# EAGLE schematic 328P & ISP (EAGLE 7.2.0)
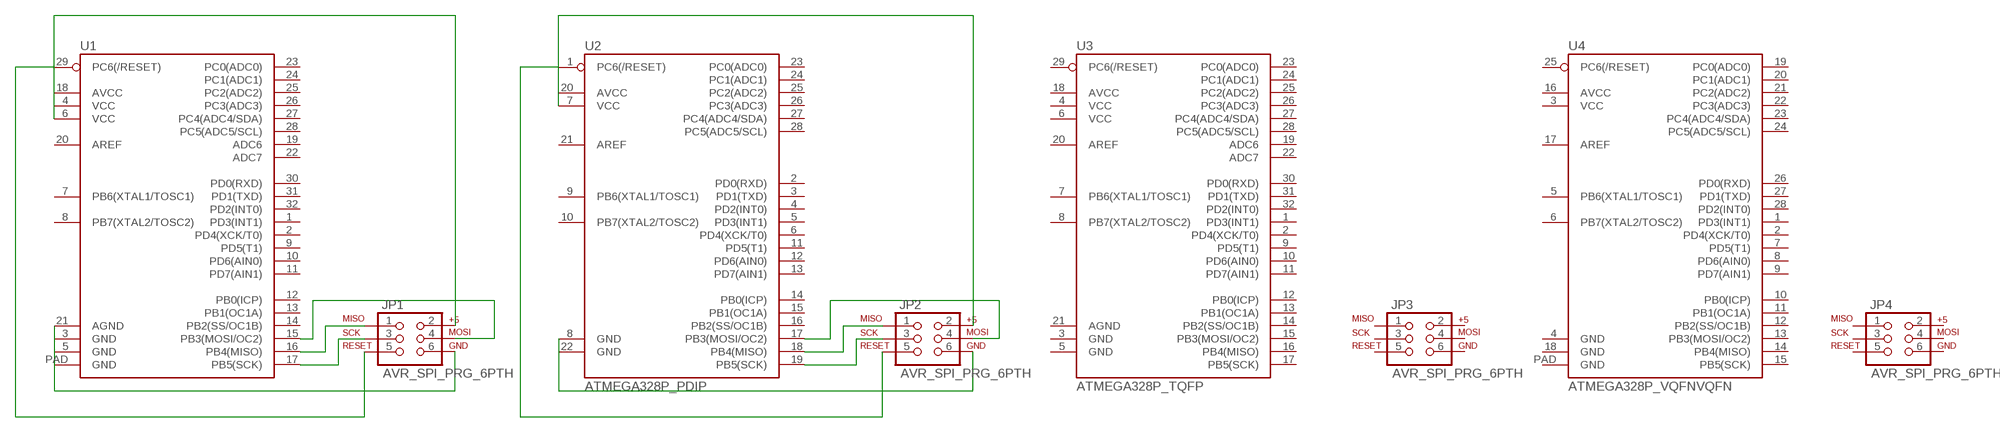
[diagram p0: schematic, sheet 1]

## Parts
JP1  AVR_SPI_PRG_6PTH  [2X3]
JP2  AVR_SPI_PRG_6PTH  [2X3]
JP3  AVR_SPI_PRG_6PTH  [2X3]
JP4  AVR_SPI_PRG_6PTH  [2X3]
U1  ATMEGA328P_MLFMLF32  [MLF32-PAD]
U2  ATMEGA328P_PDIP  [DIL28-3]
U3  ATMEGA328P_TQFP  [TQFP32-08]
U4  ATMEGA328P_VQFNVQFN  [VQFN-28]

## Nets
N$1: JP1.5 U1.29(PC6(/RESET))
N$2: JP1.3 U1.17(PB5(SCK))
N$3: JP1.1 U1.16(PB4(MISO))
N$4: JP1.4 U1.15(PB3(MOSI/OC2))
N$5: JP1.6 U1.3(GND) U1.5(GND) U1.21(AGND) U1.PAD(GND)
N$6: JP1.2 U1.4(VCC) U1.6(VCC) U1.18(AVCC)
N$7: JP2.5 U2.1(PC6(/RESET))
N$8: JP2.6 U2.8(GND) U2.22(GND)
N$9: JP2.3 U2.19(PB5(SCK))
N$10: JP2.1 U2.18(PB4(MISO))
N$11: JP2.4 U2.17(PB3(MOSI/OC2))
N$12: JP2.2 U2.7(VCC) U2.20(AVCC)
Unconnected: JP3.1 JP3.2 JP3.3 JP3.4 JP3.5 JP3.6 JP4.1 JP4.2 JP4.3 JP4.4 JP4.5 JP4.6 U1.1(PD3(INT1)) U1.2(PD4(XCK/T0)) U1.7(PB6(XTAL1/TOSC1)) U1.8(PB7(XTAL2/TOSC2)) U1.9(PD5(T1)) U1.10(PD6(AIN0)) U1.11(PD7(AIN1)) U1.12(PB0(ICP)) U1.13(PB1(OC1A)) U1.14(PB2(SS/OC1B)) U1.19(ADC6) U1.20(AREF) U1.22(ADC7) U1.23(PC0(ADC0)) U1.24(PC1(ADC1)) U1.25(PC2(ADC2)) U1.26(PC3(ADC3)) U1.27(PC4(ADC4/SDA)) U1.28(PC5(ADC5/SCL)) U1.30(PD0(RXD)) U1.31(PD1(TXD)) U1.32(PD2(INT0)) U2.2(PD0(RXD)) U2.3(PD1(TXD)) U2.4(PD2(INT0)) U2.5(PD3(INT1)) U2.6(PD4(XCK/T0)) U2.9(PB6(XTAL1/TOSC1)) U2.10(PB7(XTAL2/TOSC2)) U2.11(PD5(T1)) U2.12(PD6(AIN0)) U2.13(PD7(AIN1)) U2.14(PB0(ICP)) U2.15(PB1(OC1A)) U2.16(PB2(SS/OC1B)) U2.21(AREF) U2.23(PC0(ADC0)) U2.24(PC1(ADC1)) U2.25(PC2(ADC2)) U2.26(PC3(ADC3)) U2.27(PC4(ADC4/SDA)) U2.28(PC5(ADC5/SCL)) U3.1(PD3(INT1)) U3.2(PD4(XCK/T0)) U3.3(GND) U3.4(VCC) U3.5(GND) U3.6(VCC) U3.7(PB6(XTAL1/TOSC1)) U3.8(PB7(XTAL2/TOSC2)) U3.9(PD5(T1)) U3.10(PD6(AIN0)) U3.11(PD7(AIN1)) U3.12(PB0(ICP)) U3.13(PB1(OC1A)) U3.14(PB2(SS/OC1B)) U3.15(PB3(MOSI/OC2)) U3.16(PB4(MISO)) U3.17(PB5(SCK)) U3.18(AVCC) U3.19(ADC6) U3.20(AREF) U3.21(AGND) U3.22(ADC7) U3.23(PC0(ADC0)) U3.24(PC1(ADC1)) U3.25(PC2(ADC2)) U3.26(PC3(ADC3)) U3.27(PC4(ADC4/SDA)) U3.28(PC5(ADC5/SCL)) U3.29(PC6(/RESET)) U3.30(PD0(RXD)) U3.31(PD1(TXD)) U3.32(PD2(INT0)) U4.1(PD3(INT1)) U4.2(PD4(XCK/T0)) U4.3(VCC) U4.4(GND) U4.5(PB6(XTAL1/TOSC1)) U4.6(PB7(XTAL2/TOSC2)) U4.7(PD5(T1)) U4.8(PD6(AIN0)) U4.9(PD7(AIN1)) U4.10(PB0(ICP)) U4.11(PB1(OC1A)) U4.12(PB2(SS/OC1B)) U4.13(PB3(MOSI/OC2)) U4.14(PB4(MISO)) U4.15(PB5(SCK)) U4.16(AVCC) U4.17(AREF) U4.18(GND) U4.19(PC0(ADC0)) U4.20(PC1(ADC1)) U4.21(PC2(ADC2)) U4.22(PC3(ADC3)) U4.23(PC4(ADC4/SDA)) U4.24(PC5(ADC5/SCL)) U4.25(PC6(/RESET)) U4.26(PD0(RXD)) U4.27(PD1(TXD)) U4.28(PD2(INT0)) U4.PAD(GND)

## Library data of the parts
JP1-JP4 = SparkFun-Connectors:AVR_SPI_PRG_6: AVR ISP 6 Pin This is the reduced ISP connector for AVR programming. Common on Arduino. This footprint will take up less PCB space and can be used with a 10-pin to 6-pin adapter such as SKU: BOB-08508 **Special note about "TEST_POINT" package. The stop mask is on the top side, so if you want your programming test points to be on the bottom of your board, make sure to place this package on the bottom side of the board. This also ensure that the orientation to program from the bottom side will be correct.
U1 = SparkFun-DigitalIC:ATMEGA328P_MLF: 32-Pin Atmega328 part Commonly used on Arduino compatible boards Available in QFP and QFN packages TQFP is IC-09069 QFN is non-stock
U2 = SparkFun-DigitalIC:ATMEGA328P_PDIP: uC used in the Arduino 32kb flash, 1k EEPROM, 2k SRAM This is the through-hole version of this chip.
U3 = SparkFun-DigitalIC:ATMEGA328P_TQFP; PROD_ID: IC-09069
U4 = SparkFun-DigitalIC:ATMEGA328P_VQFN